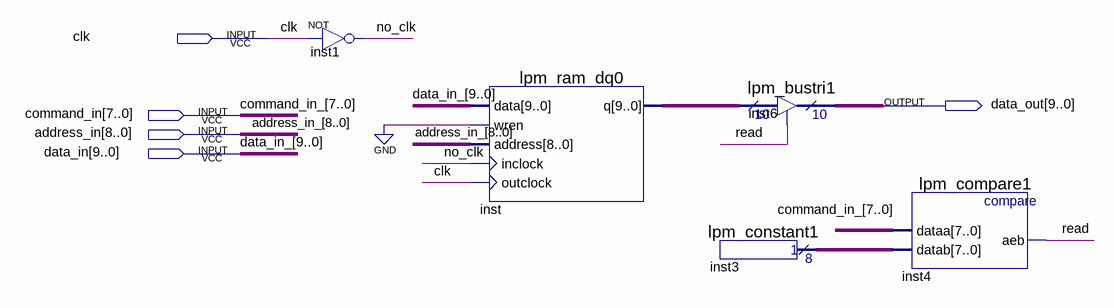
[diagram p0: schematic sheet]
// Quartus schematic RAM.bdf as structural Verilog: 5 symbols, 5 pins
module RAM (
  input  clk,
  input  [7:0] command_in,
  input  [8:0] address_in,
  input  [9:0] data_in,
  output [9:0] data_out
);

  wire no_clk, read;
  wire [7:0] inst3_result;
  wire [9:0] inst_q;

  not inst1 (no_clk, clk);
  lpm_ram_dq0 inst (.data(data_in), .wren(1'b0), .address(address_in), .inclock(no_clk), .outclock(clk), .q(inst_q));
  lpm_constant1 inst3 (.result(inst3_result));
  lpm_bustri1 inst6 (.enabledt(read), .data(inst_q), .tridata(data_out));
  lpm_compare1 inst4 (.dataa(command_in), .datab(inst3_result), .aeb(read));

  // Other names for the same wires on the sheet: address_in_[8:0] = address_in; command_in_[7:0] = command_in;
  //   data_in_[9:0] = data_in
endmodule
